# EAGLE design rtcc (EAGLE 8.1.0)
PART_NUM: MCP79410; REV: A; TITLE: MCP79410 Breakout
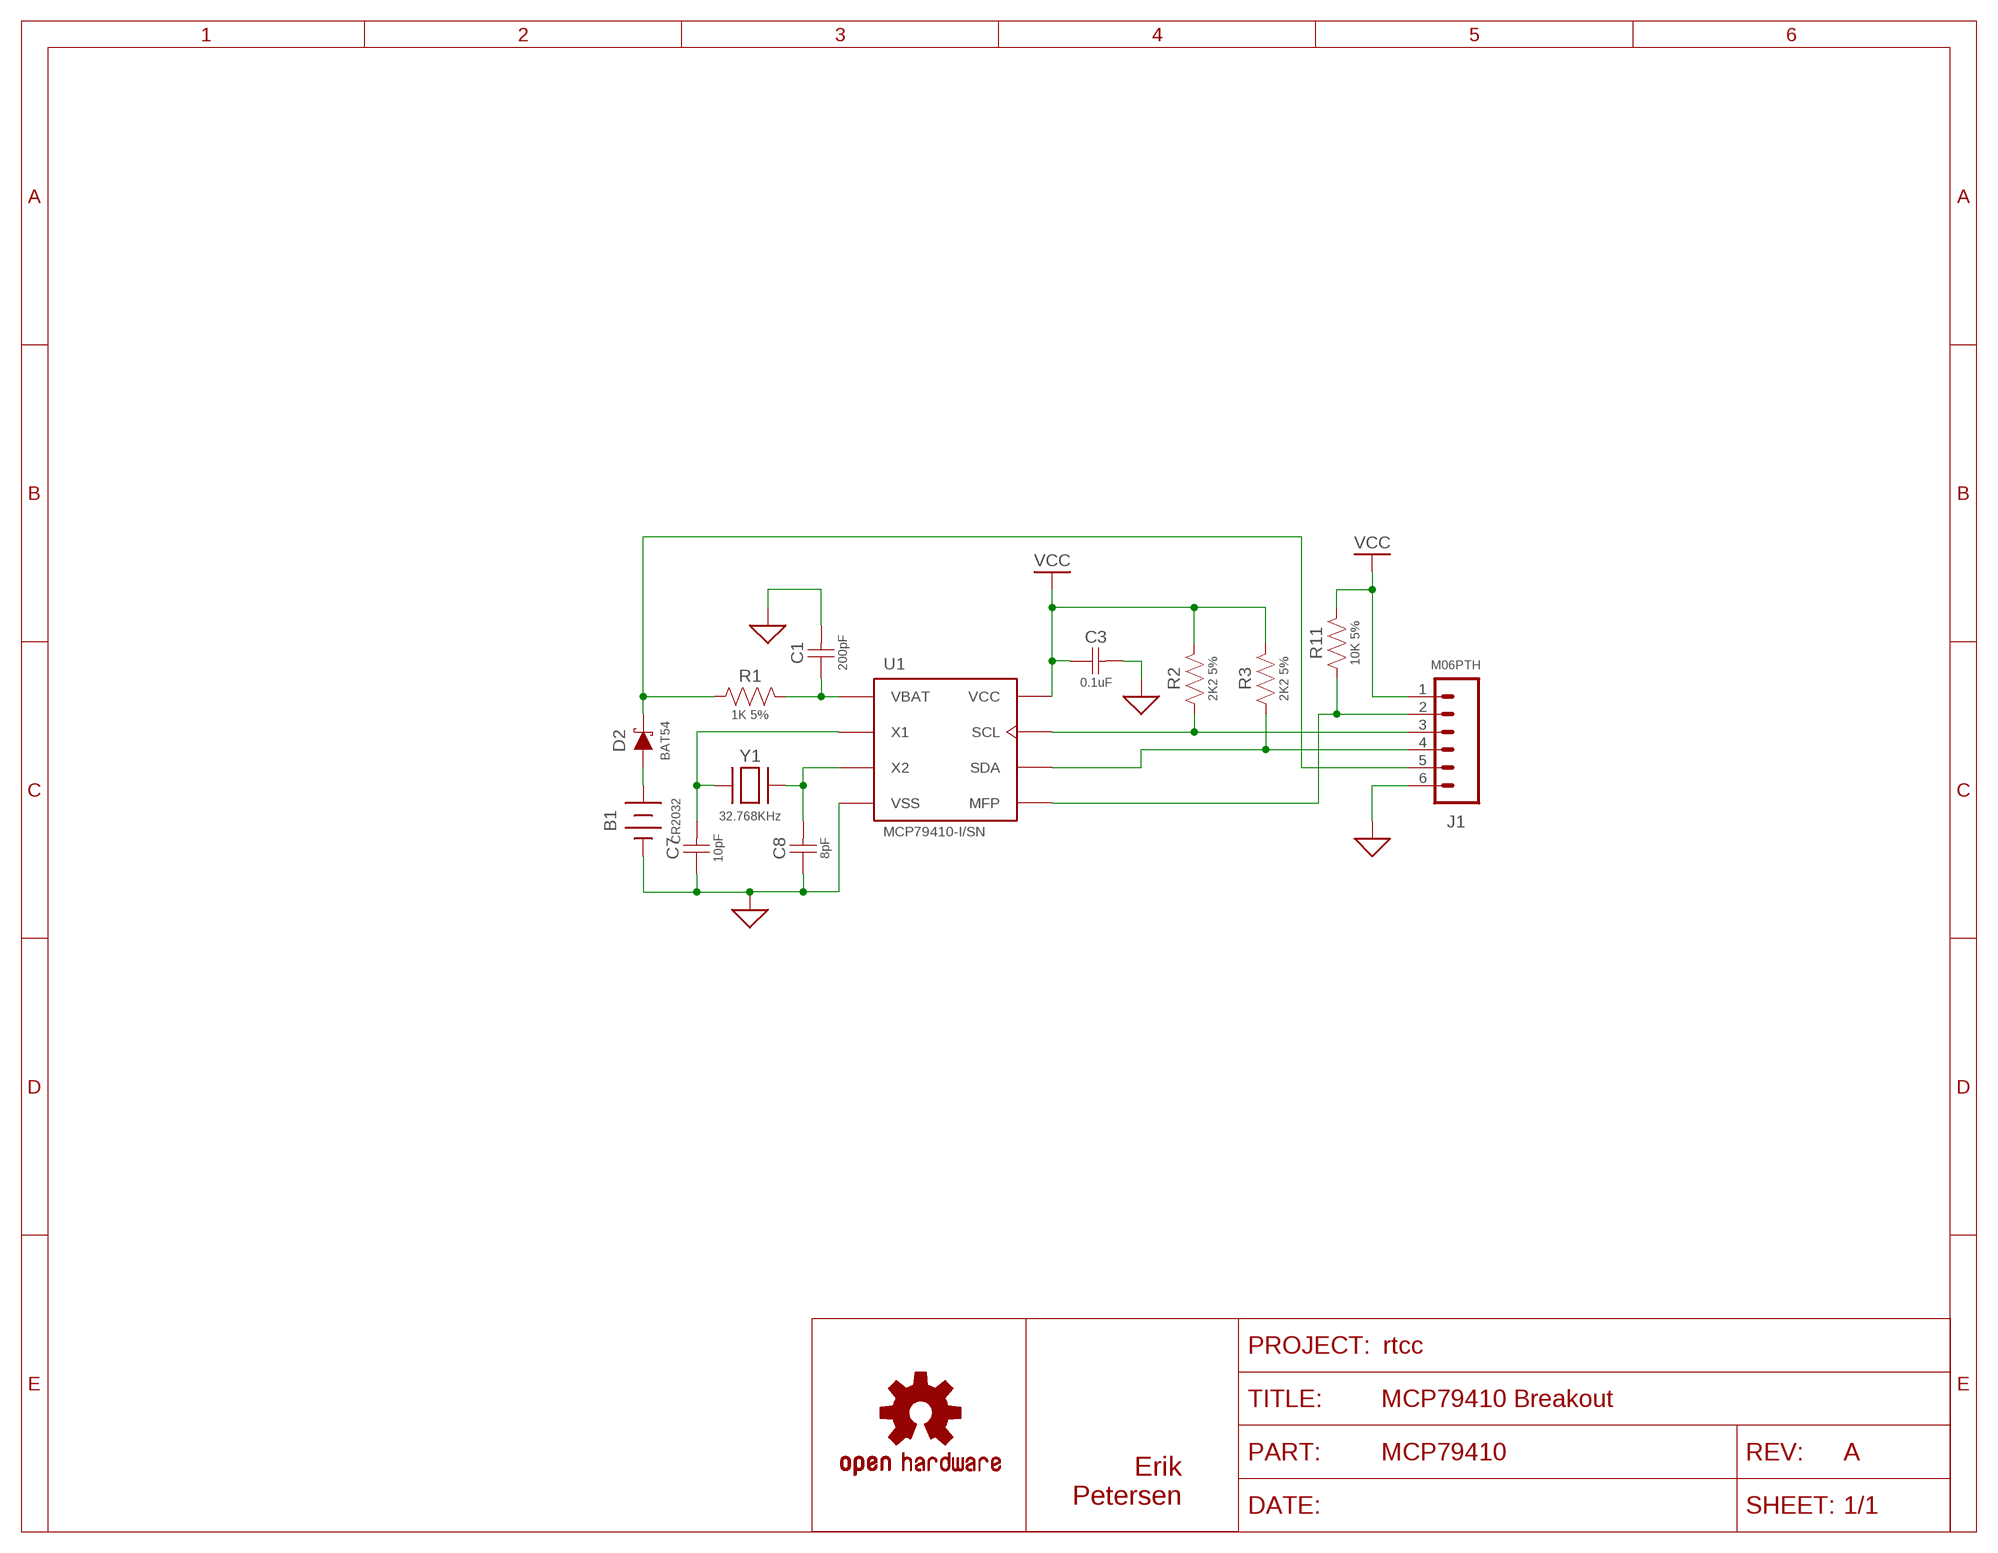
[diagram p0: schematic, sheet 1]

## Parts
B1  CR2032  BK-912  [BK-912]
C1  200pF  GRM1885C1H201JA01  [18-0603]
C3  0.1uF  GRM188R71E104KA01  [18-0603]
C7  10pF  GRM1885C1H100JA01NS  [18-0603_NOSILK]
C8  8pF  GRM1885C1H8R0DZ01NS  [18-0603_NOSILK]
D2  BAT54  [SOT23-3]
J1  M06PTH  [1X06]
LOGO1  OSHW-LOGOS  [OSHW-LOGO-S]
R1  1K 5%  ERJ-3GEYJ102  [R0603]
R2  2K2 5%  ERJ-3GEYJ222  [R0603]
R3  2K2 5%  ERJ-3GEYJ222  [R0603]
R11  10K 5%  ERJ-3GEYJ103  [R0603]
U1  MCP79410-I/SN  [SOIC8-N_MC]
Y1  32.768KHz  CM200C32768DZBT  [4-SOJ]

## Nets
BSENSE: D2.C J1.5 R1.1
GND: B1.NEG(GND) C1.2 C3.2 C7.1 C8.1 J1.6 U1.4(VSS)
RTCMFP: J1.2 R11.1 U1.7(MFP)
SCL: J1.3 R2.1 U1.6(SCL)
SDA: J1.4 R3.1 U1.5(SDA)
VBAT: B1.POS1(VBAT) B1.POS2(VBAT) D2.A
VBAT_IN: C1.1 R1.2 U1.3(VBAT)
VCC: C3.1 J1.1 R2.2 R3.2 R11.2 U1.8(VCC)
Y1: C7.2 U1.1(X1) Y1.1(A)
Y2: C8.2 U1.2(X2) Y1.4(B)

## Library data of the parts
B1 = C3-Battery:BK-912: MPD BK-912 SMD 20mm Coin Cell Battery Holder Datasheet <http://www.memoryprotectiondevices.com/datasheets/BK-912-datasheet.pdf>
C1 = C3-Murata:GRM18*: Murata Chip Capacitor 0603 Size; SIZE: 0603; TEMPCO: C0G; TOLERANCE: ±5%; VOLTAGE: 50V
C3 = C3-Murata:GRM18*: Murata Chip Capacitor 0603 Size; SIZE: 0603; TEMPCO: X7R; TOLERANCE: ±10%; VOLTAGE: 25V
C7 C8 = C3-Murata:GRM18*: Murata Chip Capacitor 0603 Size
D2 = C3-RCL:BAT54: FAIRCHILD SINGLE SCHOTTKY DIODE
J1 = C3-Connector:M06: Header 6 Standard 6-pin 0.1" header. Use with straight break away headers (SKU : PRT-00116), right angle break away headers (PRT-00553), swiss pins (PRT-00743), machine pins (PRT-00117), and female headers (PRT-00115). Molex polarized connector foot print use with SKU : PRT-08230 with associated crimp pins and housings.
LOGO1 = C3-General:OSHW-LOGO: Open Source Hardware Logo This logo indicates the piece of hardware it is found on incorporates a OSHW license and/or adheres to the definition of open source hardware found here: http://freedomdefined.org/OSHW
R1-R3 R11 = C3-Panasonic:ERJ-?*: Panasonic ERJ Thick Film Chip Resistor
U1 = C3-Microchip:MCP794*-I/?: MCP79XXX RTCC Real Time Clock Calendar - I2C Bus Datasheet <http://ww1.microchip.com/downloads/en/DeviceDoc/20002266H.pdf> Product Guide <http://www.microchip.com/design-centers/real-time-clock-calendar> Digikey Catalog <https://www.digikey.ca/products/en/integrated-circuits-ics/clock-timing-real-time-clocks/690?k=mcp79> I2C Real-Time Clock/Calendar with EEPROM, SRAM, Unique ID and Battery Switchover, I2C Bus interface
Y1 = C3-General:CM200C32768*: Citizen CM Series 32.768KHz Tuning Fork Crystal All CM series of SMD tuning fork crystals from Citizen are excellent choices for clock sources in small mobile telecommunications devices as well as any portable equipment requiring low power consumption. The CM130 series features a 1.4 x 6.9 x 1.3 mm SMD plastic package with an embedded heat resistant cylinder type crystal. Load capacitance is 12.5 pf. The frequency tolerance is ±20 ppm at25°C with an operating temperature range of -40°C to +85°C. The CM315 series features an ultra-lightweight and miniature 3.3 x 1.6 x 0.9 mm SMD ceramic package. There are load capacitance choices of 7.0, 9.0, and 12.5 pf. There are frequency tolerance choices of ±10 and ±20 ppm at 25°C with an operating temperature range of -40°C to +85°C. The CM415 series features a thin and lightweight 4.2 x 1.6 x 0.9 mm SMD ceramic package. There are load capacitance choices of 7.0, 9.0, and 12.5 pf. There are frequency tolerance choices of ±10 and ±20 ppm at 25°C with an operating temperature range of -40°C to +85°C. The CM519 series features a thin and lightweight 5.1 x 2.0 x 1.0 mm SMD ceramic package. There are load capacitance choices of 7.0, 9.0, and 12.5 pf. There are frequency tolerance choices of ±10 and ±20 ppm at 25°C with an operating temperature range of -40°C to +85°C. The CM200C Series features an 8.0 x 3.8 x 2.55 mm SMD plastic package embedded with a heat resistant cylinder type crystal. There are load capacitance choices of 6.0 and 12.5 pf. There are frequency tolerance choices of ±5, ±10, ±20, and ±30 ppm at 25°C with an operating temperature range of -40°C to +85°C. Product Catalog <https://www.digikey.ca/en/product-highlight/c/citizen-finetech-miyota/cm-series-32khz-crystals>; CL: 6pF

## Board
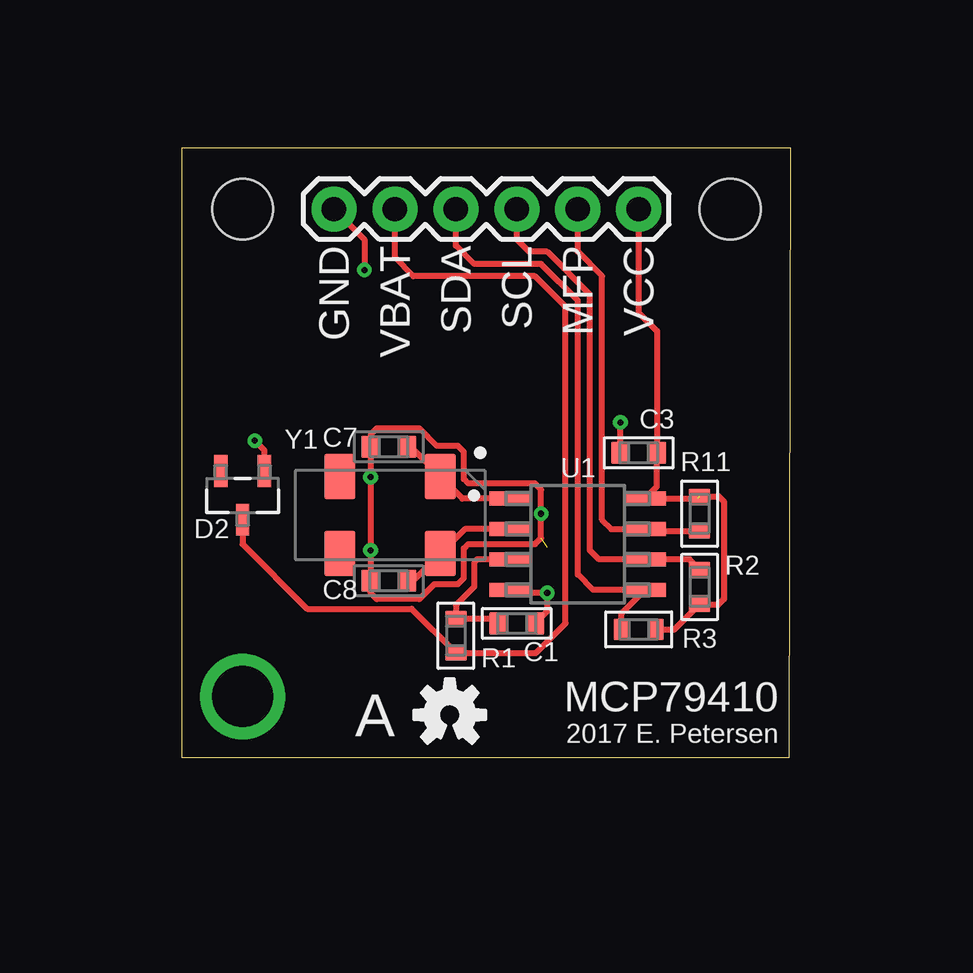
[diagram p1: board, top side]
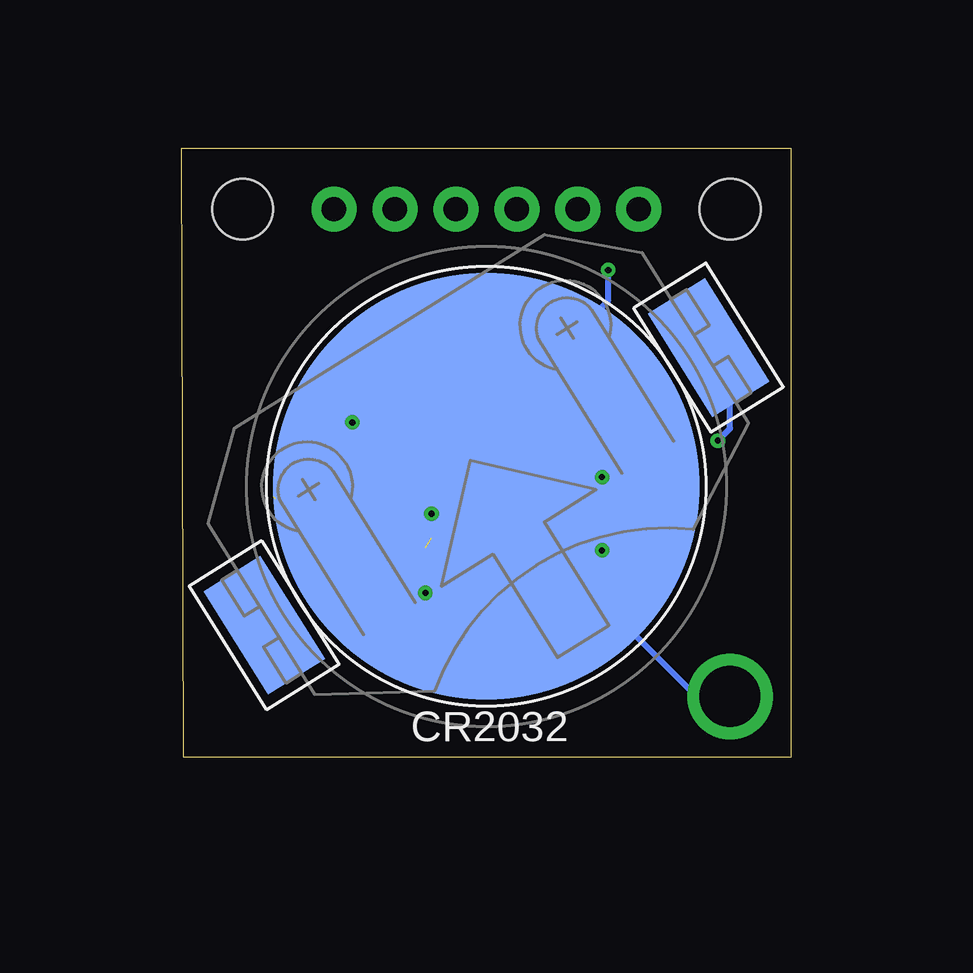
[diagram p2: board, bottom side, seen from below]

Size 25.4 x 25.4 mm. Coordinates in mm from the lower left corner, seen from the top.
Outline: 0,0 25.32,0 25.4,25.4 0,25.4 0,0
Copper layers (1*16): Top 0.0356mm / dielectric 1.5011mm / Bottom 0.0356mm
Design rules "oshpark-2layer *": minimum track width 6mil, minimum drill 10mil, track to track 6mil, track to pad 6mil, pad to pad 6mil, via to via 6mil, smd to smd 6mil, copper to edge 15mil, drill to drill 6mil, minimum pad ring 7mil, minimum via ring 7mil, stop-mask expansion 2.5mil, vias tented up to drill 0mil, thermal gap 10mil
Holes 2.54 mm at 2.54,22.86 22.86,22.86

### Footprints (pad centres in the part's own frame; a part is rotated, then mirrored left to right if it is on the bottom)
BK-912 = smd 17.78 x 17.78: NEG 0,0 | smd 2.794 x 5.08: POS1 10.922,0; POS2 -10.922,0
18-0603 = smd 0.8 x 0.9: 1 -0.75,0; 2 0.75,0
18-0603_NOSILK = smd 0.8 x 0.9: 1 -0.75,0; 2 0.75,0
SOT23-3 = smd 1.321 x 0.559: A -1.016,0.914; C 1.016,0; NC -1.016,-0.914
1X06 = drill 1.016 pad 1.88: 1 0,0; 2 2.54,0; 3 5.08,0; 4 7.62,0; 5 10.16,0; 6 12.7,0
R0603 = smd 0.65 x 0.9: 1 -0.725,0; 2 0.725,0
SOIC8-N_MC = smd 1.75 x 0.6: 1 -2.8,1.905; 2 -2.8,0.635; 3 -2.8,-0.635; 4 -2.8,-1.905; 5 2.8,-1.905; 6 2.8,-0.635; 7 2.8,0.635; 8 2.8,1.905
4-SOJ = smd 1.9 x 1.3: 1 -1.55,2.15; 2 -1.55,-2.05; 3 1.65,-2.05; 4 1.65,2.15

### Placement (x,y rotation side)
B1  12.7,11.3 32 bottom
C1  13.97,5.59 0 top
C3  19.05,12.7 180 top
C7  8.64,12.95 0 top
C8  8.64,7.37 0 top
D2  2.54,10.92 270 top
J1  19.05,22.86 180 top
LOGO1  11.18,1.78 0 top
R1  11.43,5.08 90 top
R2  21.59,7.11 270 top
R3  19.05,5.33 0 top
R11  21.59,10.16 90 top
U1  16.51,8.89 0 top
Y1  8.64,10.16 270 top

### Tracks (layer width: path | path; a pad name or v marks a point on that pad's centre or on a via)
BSENSE
  Top 0.254: R1.1 11.39,4.32 | R1.1 14.77,4.36 16,5.59 16,18.8 14.73,20.07 9.65,20.07 8.89,20.83 J1.5 | R1.1 9.59,6.2 5.23,6.2 2.54,8.89 D2.C
GND  (via drill 0.25 pad 0.51, 2.54 pad 3.17)  (1 unrouted)
  Top 0.254: C3.2 18.29,12.71 v18.29,13.97 | C1.2 15.24,6.11 v15.24,6.86 13.84,6.86 U1.4 | J1.6 7.62,21.59 v7.62,20.32 | 10.53,7.23 11.52,7.23 11.77,7.48 11.77,8.72 11.94,8.89 14.73,8.89 14.99,9.14 v14.99,10.16 14.99,11.16 14.72,11.43 13.47,11.43 13.46,11.43 11.94,11.43 11.77,11.6 11.77,12.74 11.52,12.99 10.63,12.99 9.91,13.72 8.13,13.72 7.87,13.46 7.87,12.97 C7.1 7.87,12.94 v7.87,11.68 v7.87,8.64 7.87,7.38 C8.1 7.87,7.35 7.87,6.86 8.13,6.6 9.91,6.6 10.53,7.23
  Bottom 0.254: B1.NEG 12.7,13.97 7.62,19.05 v7.62,20.32 | B1.NEG 15.24,8.76 v15.24,6.86 | B1.NEG 15.37,13.97 v18.29,13.97 | B1.NEG 3.94,2.54 v2.54,2.54
RTCMFP
  Top 0.254: J1.2 16.51,21.08 17.53,20.07 17.53,9.91 17.91,9.53 U1.7 19.4,9.44 R11.1
SCL
  Top 0.254: J1.3 13.97,21.59 14.48,21.08 15.24,21.08 17.02,19.3 17.02,8.64 17.4,8.26 U1.6 21.17,8.26 R2.1
SDA
  Top 0.254: J1.4 11.43,21.34 12.19,20.57 14.99,20.57 16.51,19.05 16.51,7.62 17.14,6.99 U1.5 18.32,6 R3.1
VBAT  (via drill 0.25 pad 0.51)
  Top 0.254: D2.A 3.45,12.8 v3.05,13.21
  Bottom 0.254: v3.05,13.21 2.54,13.72 2.54,16.51 3.44,17.41 B1.POS1
VBAT_IN
  Top 0.254: U1.3 12.32,8.26 12.19,8.13 12.19,7.11 11.43,6.35 R1.2 13,5.8 C1.1
VCC  (1 unrouted)
  Top 0.254: 21.5,10.79 U1.8 19.8,11.29 C3.1 19.81,12.71 19.81,17.78 19.05,18.54 J1.1 | R3.2 20.54,5.33 R2.2 21.63,6.35 22.35,6.35 22.61,6.6 22.61,10.67 22.39,10.88 R11.2
Y1
  Top 0.254: C7.2 9.54,12.95 Y1.1 11.7,10.79 U1.1
Y2
  Top 0.254: C8.2 9.64,7.37 Y1.4 11.8,9.53 U1.2

### Text on the board
tPlace: GND | VBAT | SDA | SCL | MFP | VCC | 2017 E. Petersen